# Altium schematic sheet ModuleBoard_Interface.SchDoc: Module Board Interface
size B; SheetNumber: 4; SheetTotal: 6
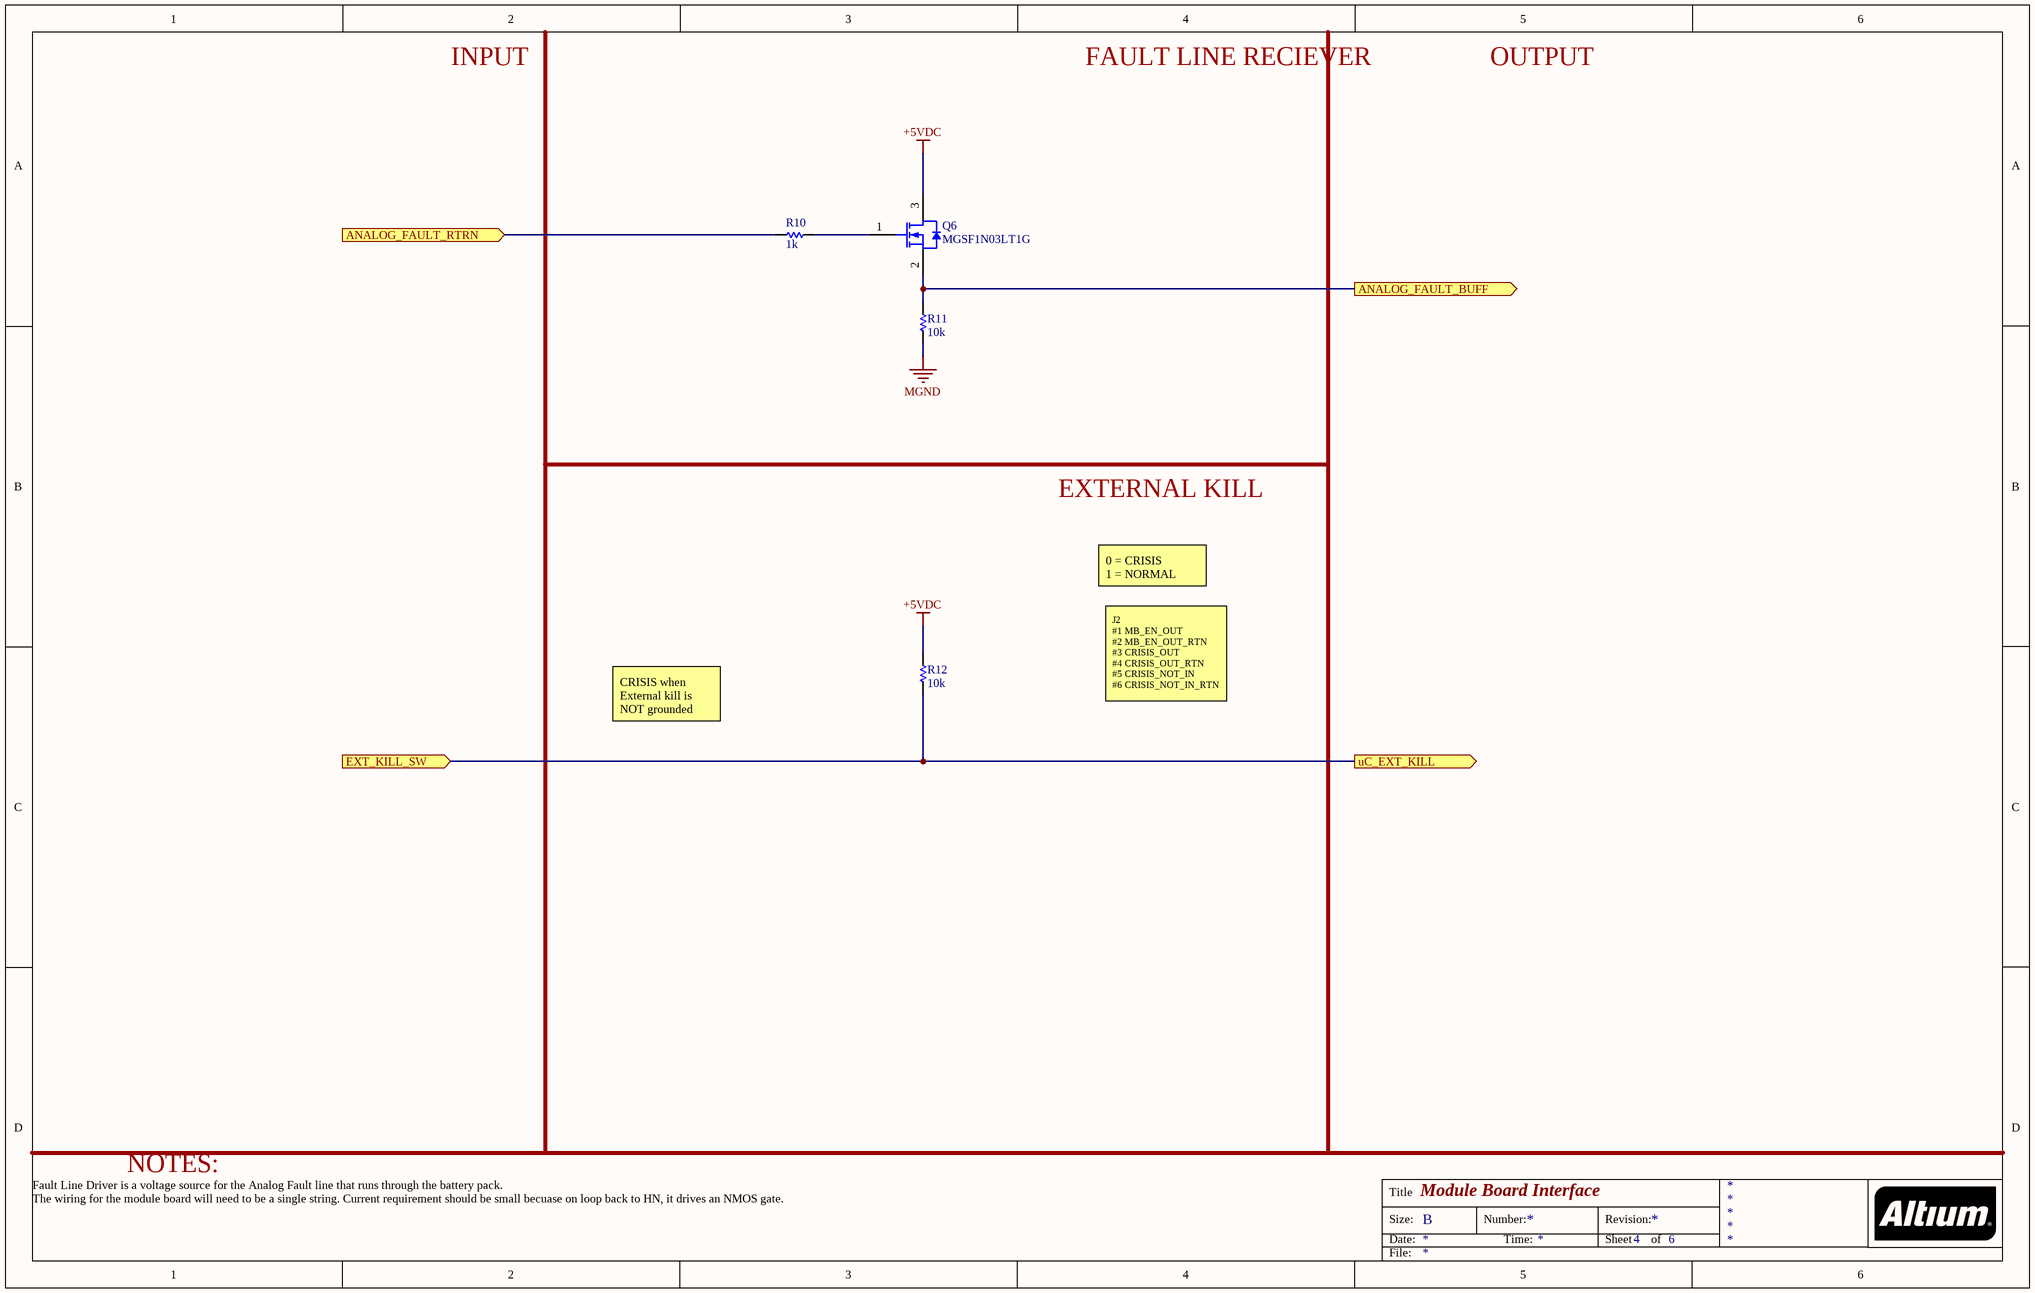
[diagram p0: ModuleBoard_Interface.SchDoc]

## Parts
Q6  MGSF1N03LT1G  [ONSC-SOT-23-3-318-08_V]
R10  SchematicInformation: 1k  [R_0603]  (hidden comment: RES_1k_1%_0603)
R11  SchematicInformation: 10k  [R_0603]  (hidden comment: RES_10k_1%_0603)
R12  SchematicInformation: 10k  [R_0603]  (hidden comment: RES_10k_1%_0603)

## Ports
ANALOG_FAULT_BUFF (out), ANALOG_FAULT_RTRN (in), EXT_KILL_SW (in), uC_EXT_KILL (out)

## Nets
+5VDC: Q6.3(D) R12.2
MGND: R11.1
ANALOG_FAULT_BUFF: Q6.2(S) R11.2 ; port ANALOG_FAULT_BUFF
ANALOG_FAULT_RTRN: R10.1 ; port ANALOG_FAULT_RTRN
EXT_KILL_SW: R12.1 ; port EXT_KILL_SW, port uC_EXT_KILL
NetQ6_1: Q6.1(G) R10.2

## Notes on the sheet
- INPUT
- FAULT LINE RECIEVER
- OUTPUT
- EXTERNAL KILL
- 0 = CRISIS
  1 = NORMAL
- J2
  #1 MB_EN_OUT
  #2 MB_EN_OUT_RTN
  #3 CRISIS_OUT
  #4 CRISIS_OUT_RTN
  #5 CRISIS_NOT_IN
  #6 CRISIS_NOT_IN_RTN
- CRISIS when External kill is NOT grounded
- NOTES:
- Fault Line Driver is a voltage source for the Analog Fault line that runs through the battery pack.
- The wiring for the module board will need to be a single string. Current requirement should be small becuase on loop back to HN, it drives an NMOS gate.
- Title
- Size:
- Date:
- B
- Number:
- Time:
- Revision:
- Sheet
- of
- File:

## Library data of the parts
Q6 = CMP-1058-00778-1: Power MOSFET, 30 V, 2.1 A, Single N-Channel, 3-Pin SOT-23, Pb-Free, Tape and Reel; Manufacturer: On Semiconductor; VGS(th) Max (V): 2.4; Channel Polarity: N Channel; Ciss Typ (pF): 140; Crss Typ (pF): 40; Coss Typ (pF): 100; V(BR)DSS Min (V): 30; ID Max (A): 2.1; VGS Max (V): 20; ComponentLink1Description: Manufacturer URL; PartNumber: MGSF1N03LT1G; Packing: Tape and Reel; DatasheetVersion: Rev. 10; ComponentLink1URL: http://www.onsemi.com/; Mounting Technology: Surface Mount; PackageVersion: Rev. AP, 11/2009; PackageDescription: 3-Pin Small Outline Transistor, Body 2.92 x 1.3 mm, Pitch 0.95 mm; Package Type: SOT-23-3; ComponentLink3URL: http://www.onsemi.cn/pub_link/Collateral/318-08.PDF; RoHS: Pb-Free; ComponentLink3Description: Package Specification; ComponentLink2Description: Datasheet; Configuration: Single; PackageReference: SOT-23-3-318-08; ComponentLink2URL: http://www.onsemi.cn/pub_link/Collateral/MGSF1N03LT1-D.PDF
R10 = RES_1k_1%_0603: Manufacturer Part Number: RC0603FR-071KL; Manufacturer: Yageo; DigiKey Part Number: 311-1.00KHRCT-ND
R11 R12 = RES_10k_1%_0603: Manufacturer Part Number: RC0603FR-0710KL; Manufacturer: Yageo; DigiKey Part Number: 311-10.0KHRCT-ND